# EasyEDA schematic SCH_LED-Matrix-Halflife_2026-10-07.json
TITLE: Sheet_1; REV: 1.0; Date: 2026-10-07; Sheet: 1/1; Drawn By: Farouk; Company: Your Company
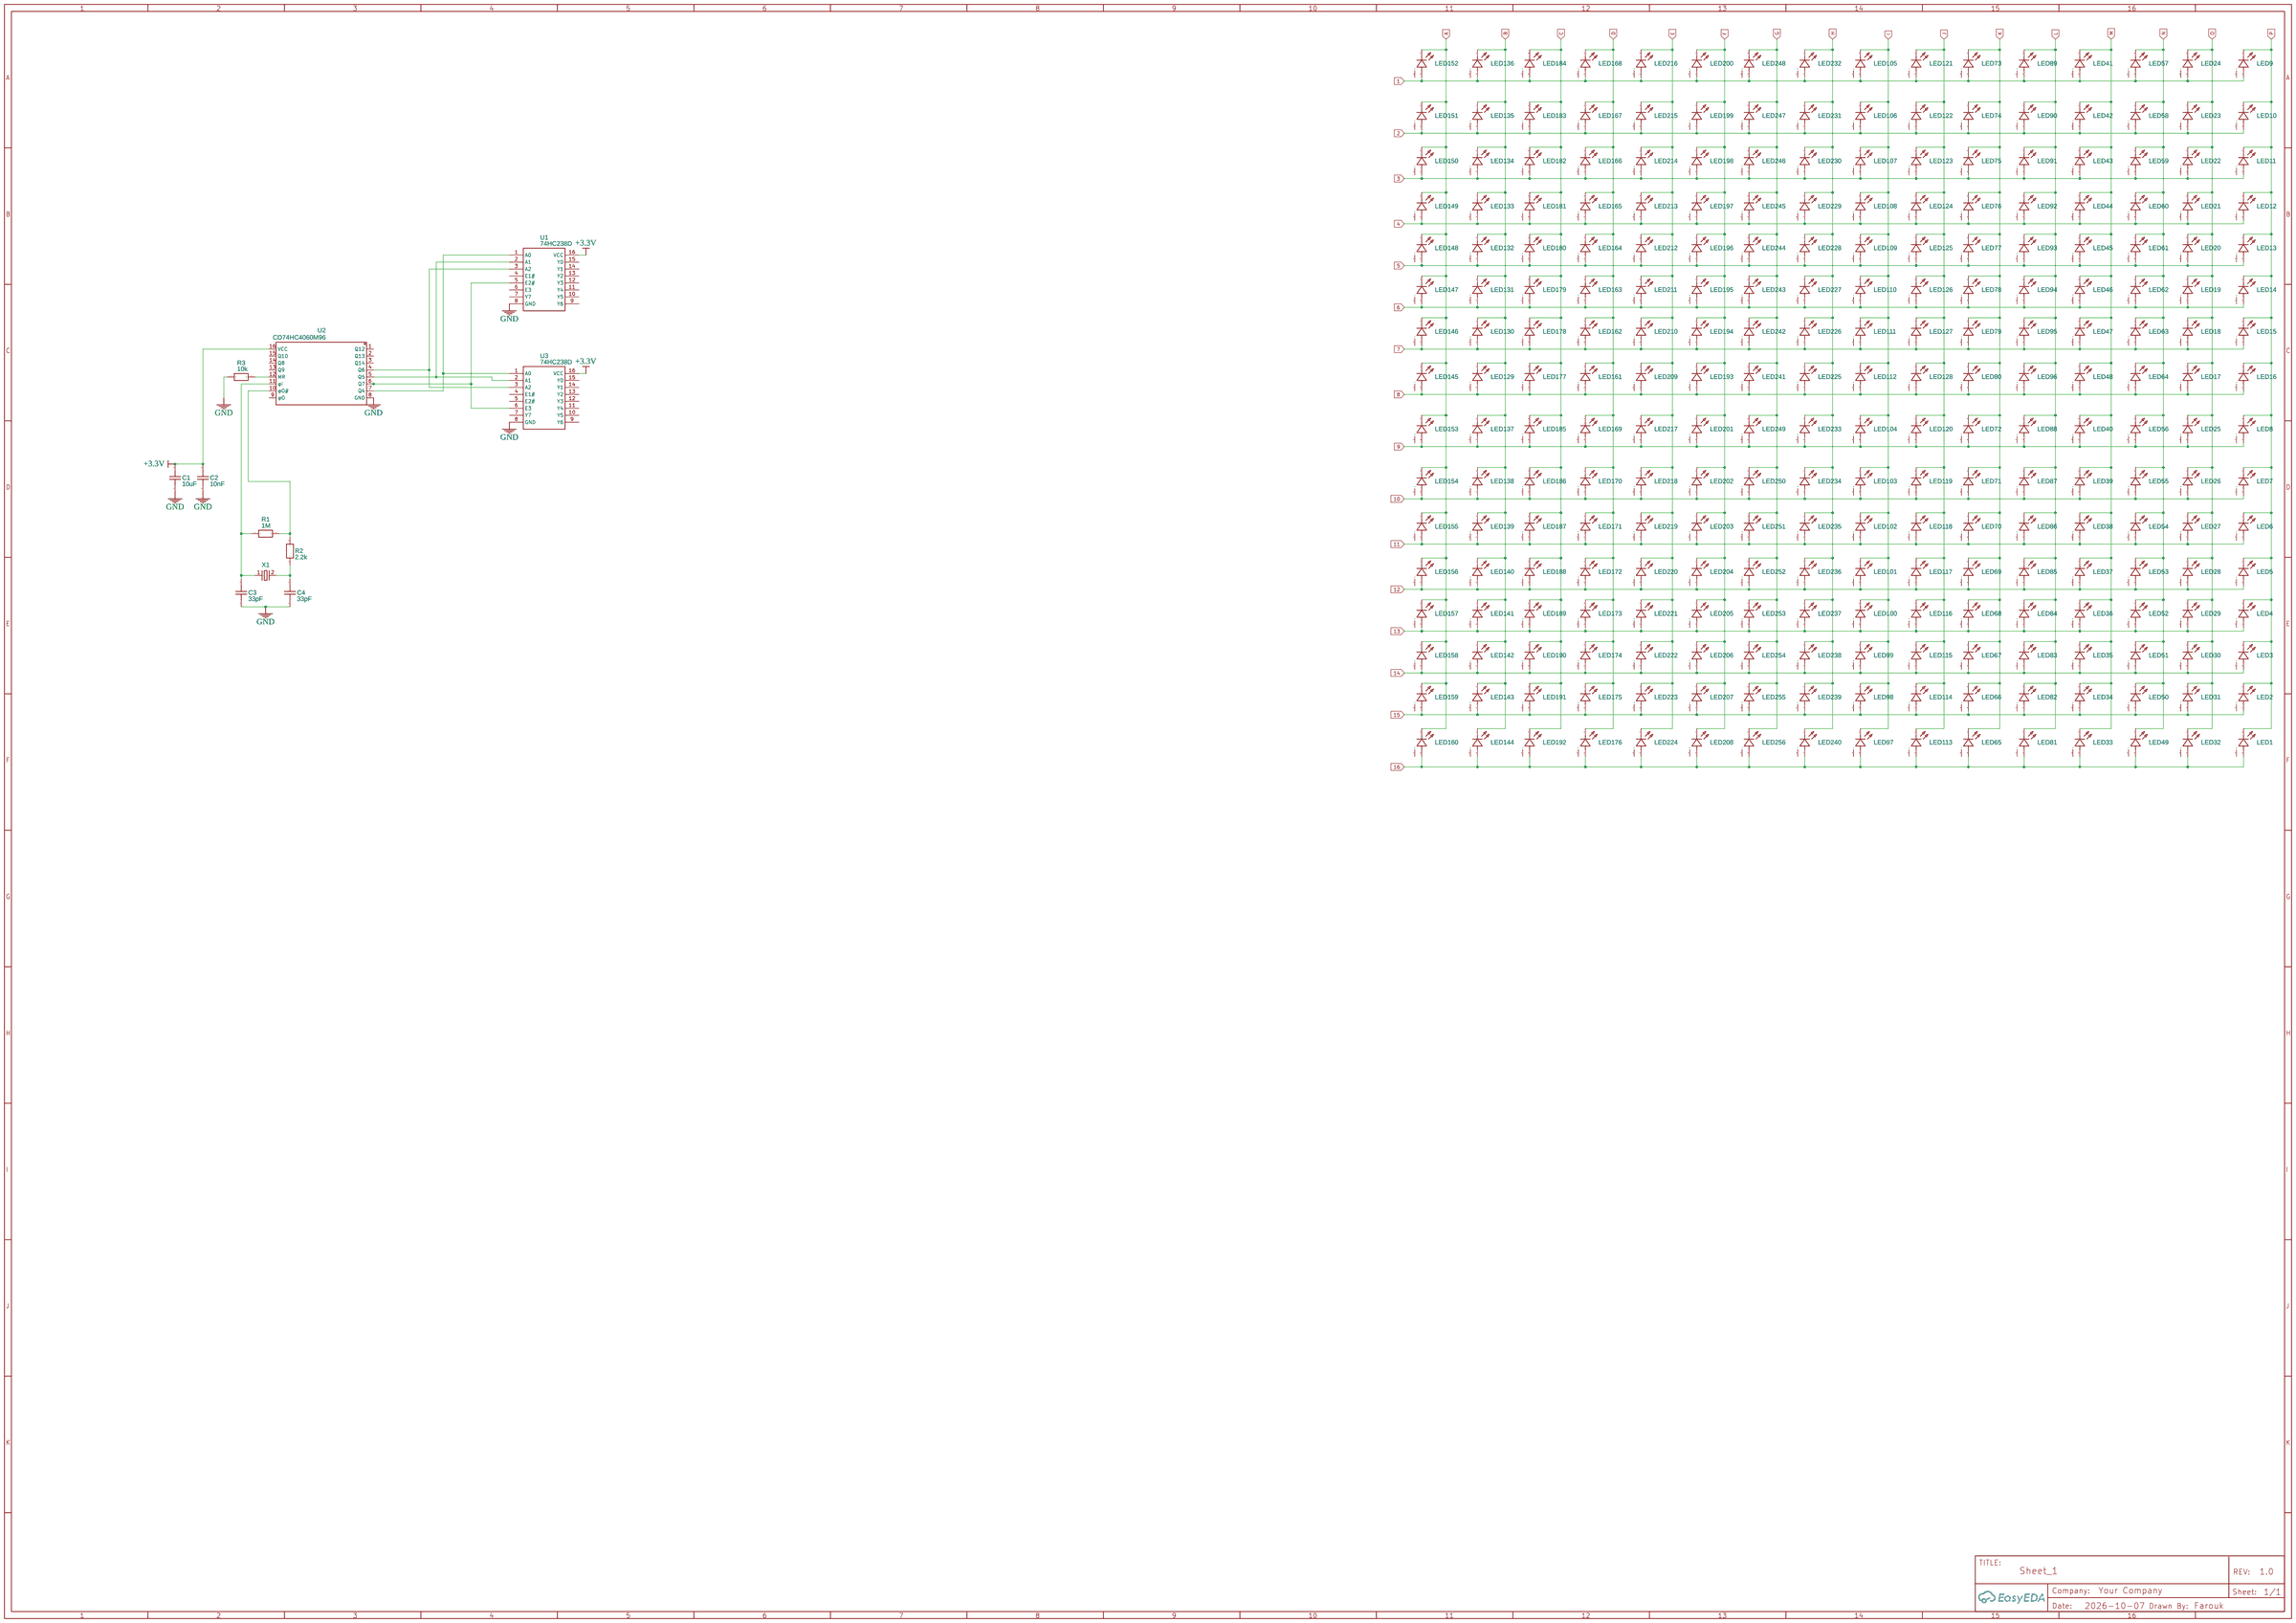
[diagram p0: schematic sheet]

## Parts
C1  10uF  [C1210]
C2  10nF  [C0805]
C3  33pF  [C0805]
C4  33pF  [C0805]
LED1  HL-A-5730D34WY-S1-08-CZ(LY)  [LED-SMD_HL-A-5730D34WY-S1-08-CZ]
LED2  HL-A-5730D34WY-S1-08-CZ(LY)  [LED-SMD_HL-A-5730D34WY-S1-08-CZ]
LED3  HL-A-5730D34WY-S1-08-CZ(LY)  [LED-SMD_HL-A-5730D34WY-S1-08-CZ]
LED4  HL-A-5730D34WY-S1-08-CZ(LY)  [LED-SMD_HL-A-5730D34WY-S1-08-CZ]
LED5  HL-A-5730D34WY-S1-08-CZ(LY)  [LED-SMD_HL-A-5730D34WY-S1-08-CZ]
LED6  HL-A-5730D34WY-S1-08-CZ(LY)  [LED-SMD_HL-A-5730D34WY-S1-08-CZ]
LED7  HL-A-5730D34WY-S1-08-CZ(LY)  [LED-SMD_HL-A-5730D34WY-S1-08-CZ]
LED8  HL-A-5730D34WY-S1-08-CZ(LY)  [LED-SMD_HL-A-5730D34WY-S1-08-CZ]
LED9  HL-A-5730D34WY-S1-08-CZ(LY)  [LED-SMD_HL-A-5730D34WY-S1-08-CZ]
LED10  HL-A-5730D34WY-S1-08-CZ(LY)  [LED-SMD_HL-A-5730D34WY-S1-08-CZ]
LED11  HL-A-5730D34WY-S1-08-CZ(LY)  [LED-SMD_HL-A-5730D34WY-S1-08-CZ]
LED12  HL-A-5730D34WY-S1-08-CZ(LY)  [LED-SMD_HL-A-5730D34WY-S1-08-CZ]
LED13  HL-A-5730D34WY-S1-08-CZ(LY)  [LED-SMD_HL-A-5730D34WY-S1-08-CZ]
LED14  HL-A-5730D34WY-S1-08-CZ(LY)  [LED-SMD_HL-A-5730D34WY-S1-08-CZ]
LED15  HL-A-5730D34WY-S1-08-CZ(LY)  [LED-SMD_HL-A-5730D34WY-S1-08-CZ]
LED16  HL-A-5730D34WY-S1-08-CZ(LY)  [LED-SMD_HL-A-5730D34WY-S1-08-CZ]
LED17  HL-A-5730D34WY-S1-08-CZ(LY)  [LED-SMD_HL-A-5730D34WY-S1-08-CZ]
LED18  HL-A-5730D34WY-S1-08-CZ(LY)  [LED-SMD_HL-A-5730D34WY-S1-08-CZ]
LED19  HL-A-5730D34WY-S1-08-CZ(LY)  [LED-SMD_HL-A-5730D34WY-S1-08-CZ]
LED20  HL-A-5730D34WY-S1-08-CZ(LY)  [LED-SMD_HL-A-5730D34WY-S1-08-CZ]
LED21  HL-A-5730D34WY-S1-08-CZ(LY)  [LED-SMD_HL-A-5730D34WY-S1-08-CZ]
LED22  HL-A-5730D34WY-S1-08-CZ(LY)  [LED-SMD_HL-A-5730D34WY-S1-08-CZ]
LED23  HL-A-5730D34WY-S1-08-CZ(LY)  [LED-SMD_HL-A-5730D34WY-S1-08-CZ]
LED24  HL-A-5730D34WY-S1-08-CZ(LY)  [LED-SMD_HL-A-5730D34WY-S1-08-CZ]
LED25  HL-A-5730D34WY-S1-08-CZ(LY)  [LED-SMD_HL-A-5730D34WY-S1-08-CZ]
LED26  HL-A-5730D34WY-S1-08-CZ(LY)  [LED-SMD_HL-A-5730D34WY-S1-08-CZ]
LED27  HL-A-5730D34WY-S1-08-CZ(LY)  [LED-SMD_HL-A-5730D34WY-S1-08-CZ]
LED28  HL-A-5730D34WY-S1-08-CZ(LY)  [LED-SMD_HL-A-5730D34WY-S1-08-CZ]
LED29  HL-A-5730D34WY-S1-08-CZ(LY)  [LED-SMD_HL-A-5730D34WY-S1-08-CZ]
LED30  HL-A-5730D34WY-S1-08-CZ(LY)  [LED-SMD_HL-A-5730D34WY-S1-08-CZ]
LED31  HL-A-5730D34WY-S1-08-CZ(LY)  [LED-SMD_HL-A-5730D34WY-S1-08-CZ]
LED32  HL-A-5730D34WY-S1-08-CZ(LY)  [LED-SMD_HL-A-5730D34WY-S1-08-CZ]
LED33  HL-A-5730D34WY-S1-08-CZ(LY)  [LED-SMD_HL-A-5730D34WY-S1-08-CZ]
LED34  HL-A-5730D34WY-S1-08-CZ(LY)  [LED-SMD_HL-A-5730D34WY-S1-08-CZ]
LED35  HL-A-5730D34WY-S1-08-CZ(LY)  [LED-SMD_HL-A-5730D34WY-S1-08-CZ]
LED36  HL-A-5730D34WY-S1-08-CZ(LY)  [LED-SMD_HL-A-5730D34WY-S1-08-CZ]
LED37  HL-A-5730D34WY-S1-08-CZ(LY)  [LED-SMD_HL-A-5730D34WY-S1-08-CZ]
LED38  HL-A-5730D34WY-S1-08-CZ(LY)  [LED-SMD_HL-A-5730D34WY-S1-08-CZ]
LED39  HL-A-5730D34WY-S1-08-CZ(LY)  [LED-SMD_HL-A-5730D34WY-S1-08-CZ]
LED40  HL-A-5730D34WY-S1-08-CZ(LY)  [LED-SMD_HL-A-5730D34WY-S1-08-CZ]
LED41  HL-A-5730D34WY-S1-08-CZ(LY)  [LED-SMD_HL-A-5730D34WY-S1-08-CZ]
LED42  HL-A-5730D34WY-S1-08-CZ(LY)  [LED-SMD_HL-A-5730D34WY-S1-08-CZ]
LED43  HL-A-5730D34WY-S1-08-CZ(LY)  [LED-SMD_HL-A-5730D34WY-S1-08-CZ]
LED44  HL-A-5730D34WY-S1-08-CZ(LY)  [LED-SMD_HL-A-5730D34WY-S1-08-CZ]
LED45  HL-A-5730D34WY-S1-08-CZ(LY)  [LED-SMD_HL-A-5730D34WY-S1-08-CZ]
LED46  HL-A-5730D34WY-S1-08-CZ(LY)  [LED-SMD_HL-A-5730D34WY-S1-08-CZ]
LED47  HL-A-5730D34WY-S1-08-CZ(LY)  [LED-SMD_HL-A-5730D34WY-S1-08-CZ]
LED48  HL-A-5730D34WY-S1-08-CZ(LY)  [LED-SMD_HL-A-5730D34WY-S1-08-CZ]
LED49  HL-A-5730D34WY-S1-08-CZ(LY)  [LED-SMD_HL-A-5730D34WY-S1-08-CZ]
LED50  HL-A-5730D34WY-S1-08-CZ(LY)  [LED-SMD_HL-A-5730D34WY-S1-08-CZ]
LED51  HL-A-5730D34WY-S1-08-CZ(LY)  [LED-SMD_HL-A-5730D34WY-S1-08-CZ]
LED52  HL-A-5730D34WY-S1-08-CZ(LY)  [LED-SMD_HL-A-5730D34WY-S1-08-CZ]
LED53  HL-A-5730D34WY-S1-08-CZ(LY)  [LED-SMD_HL-A-5730D34WY-S1-08-CZ]
LED54  HL-A-5730D34WY-S1-08-CZ(LY)  [LED-SMD_HL-A-5730D34WY-S1-08-CZ]
LED55  HL-A-5730D34WY-S1-08-CZ(LY)  [LED-SMD_HL-A-5730D34WY-S1-08-CZ]
LED56  HL-A-5730D34WY-S1-08-CZ(LY)  [LED-SMD_HL-A-5730D34WY-S1-08-CZ]
LED57  HL-A-5730D34WY-S1-08-CZ(LY)  [LED-SMD_HL-A-5730D34WY-S1-08-CZ]
LED58  HL-A-5730D34WY-S1-08-CZ(LY)  [LED-SMD_HL-A-5730D34WY-S1-08-CZ]
LED59  HL-A-5730D34WY-S1-08-CZ(LY)  [LED-SMD_HL-A-5730D34WY-S1-08-CZ]
LED60  HL-A-5730D34WY-S1-08-CZ(LY)  [LED-SMD_HL-A-5730D34WY-S1-08-CZ]
LED61  HL-A-5730D34WY-S1-08-CZ(LY)  [LED-SMD_HL-A-5730D34WY-S1-08-CZ]
LED62  HL-A-5730D34WY-S1-08-CZ(LY)  [LED-SMD_HL-A-5730D34WY-S1-08-CZ]
LED63  HL-A-5730D34WY-S1-08-CZ(LY)  [LED-SMD_HL-A-5730D34WY-S1-08-CZ]
LED64  HL-A-5730D34WY-S1-08-CZ(LY)  [LED-SMD_HL-A-5730D34WY-S1-08-CZ]
LED65  HL-A-5730D34WY-S1-08-CZ(LY)  [LED-SMD_HL-A-5730D34WY-S1-08-CZ]
LED66  HL-A-5730D34WY-S1-08-CZ(LY)  [LED-SMD_HL-A-5730D34WY-S1-08-CZ]
LED67  HL-A-5730D34WY-S1-08-CZ(LY)  [LED-SMD_HL-A-5730D34WY-S1-08-CZ]
LED68  HL-A-5730D34WY-S1-08-CZ(LY)  [LED-SMD_HL-A-5730D34WY-S1-08-CZ]
LED69  HL-A-5730D34WY-S1-08-CZ(LY)  [LED-SMD_HL-A-5730D34WY-S1-08-CZ]
LED70  HL-A-5730D34WY-S1-08-CZ(LY)  [LED-SMD_HL-A-5730D34WY-S1-08-CZ]
LED71  HL-A-5730D34WY-S1-08-CZ(LY)  [LED-SMD_HL-A-5730D34WY-S1-08-CZ]
LED72  HL-A-5730D34WY-S1-08-CZ(LY)  [LED-SMD_HL-A-5730D34WY-S1-08-CZ]
LED73  HL-A-5730D34WY-S1-08-CZ(LY)  [LED-SMD_HL-A-5730D34WY-S1-08-CZ]
LED74  HL-A-5730D34WY-S1-08-CZ(LY)  [LED-SMD_HL-A-5730D34WY-S1-08-CZ]
LED75  HL-A-5730D34WY-S1-08-CZ(LY)  [LED-SMD_HL-A-5730D34WY-S1-08-CZ]
LED76  HL-A-5730D34WY-S1-08-CZ(LY)  [LED-SMD_HL-A-5730D34WY-S1-08-CZ]
LED77  HL-A-5730D34WY-S1-08-CZ(LY)  [LED-SMD_HL-A-5730D34WY-S1-08-CZ]
LED78  HL-A-5730D34WY-S1-08-CZ(LY)  [LED-SMD_HL-A-5730D34WY-S1-08-CZ]
LED79  HL-A-5730D34WY-S1-08-CZ(LY)  [LED-SMD_HL-A-5730D34WY-S1-08-CZ]
LED80  HL-A-5730D34WY-S1-08-CZ(LY)  [LED-SMD_HL-A-5730D34WY-S1-08-CZ]
LED81  HL-A-5730D34WY-S1-08-CZ(LY)  [LED-SMD_HL-A-5730D34WY-S1-08-CZ]
LED82  HL-A-5730D34WY-S1-08-CZ(LY)  [LED-SMD_HL-A-5730D34WY-S1-08-CZ]
LED83  HL-A-5730D34WY-S1-08-CZ(LY)  [LED-SMD_HL-A-5730D34WY-S1-08-CZ]
LED84  HL-A-5730D34WY-S1-08-CZ(LY)  [LED-SMD_HL-A-5730D34WY-S1-08-CZ]
LED85  HL-A-5730D34WY-S1-08-CZ(LY)  [LED-SMD_HL-A-5730D34WY-S1-08-CZ]
LED86  HL-A-5730D34WY-S1-08-CZ(LY)  [LED-SMD_HL-A-5730D34WY-S1-08-CZ]
LED87  HL-A-5730D34WY-S1-08-CZ(LY)  [LED-SMD_HL-A-5730D34WY-S1-08-CZ]
LED88  HL-A-5730D34WY-S1-08-CZ(LY)  [LED-SMD_HL-A-5730D34WY-S1-08-CZ]
LED89  HL-A-5730D34WY-S1-08-CZ(LY)  [LED-SMD_HL-A-5730D34WY-S1-08-CZ]
LED90  HL-A-5730D34WY-S1-08-CZ(LY)  [LED-SMD_HL-A-5730D34WY-S1-08-CZ]
LED91  HL-A-5730D34WY-S1-08-CZ(LY)  [LED-SMD_HL-A-5730D34WY-S1-08-CZ]
LED92  HL-A-5730D34WY-S1-08-CZ(LY)  [LED-SMD_HL-A-5730D34WY-S1-08-CZ]
LED93  HL-A-5730D34WY-S1-08-CZ(LY)  [LED-SMD_HL-A-5730D34WY-S1-08-CZ]
LED94  HL-A-5730D34WY-S1-08-CZ(LY)  [LED-SMD_HL-A-5730D34WY-S1-08-CZ]
LED95  HL-A-5730D34WY-S1-08-CZ(LY)  [LED-SMD_HL-A-5730D34WY-S1-08-CZ]
LED96  HL-A-5730D34WY-S1-08-CZ(LY)  [LED-SMD_HL-A-5730D34WY-S1-08-CZ]
LED97  HL-A-5730D34WY-S1-08-CZ(LY)  [LED-SMD_HL-A-5730D34WY-S1-08-CZ]
LED98  HL-A-5730D34WY-S1-08-CZ(LY)  [LED-SMD_HL-A-5730D34WY-S1-08-CZ]
LED99  HL-A-5730D34WY-S1-08-CZ(LY)  [LED-SMD_HL-A-5730D34WY-S1-08-CZ]
LED100  HL-A-5730D34WY-S1-08-CZ(LY)  [LED-SMD_HL-A-5730D34WY-S1-08-CZ]
LED101  HL-A-5730D34WY-S1-08-CZ(LY)  [LED-SMD_HL-A-5730D34WY-S1-08-CZ]
LED102  HL-A-5730D34WY-S1-08-CZ(LY)  [LED-SMD_HL-A-5730D34WY-S1-08-CZ]
LED103  HL-A-5730D34WY-S1-08-CZ(LY)  [LED-SMD_HL-A-5730D34WY-S1-08-CZ]
LED104  HL-A-5730D34WY-S1-08-CZ(LY)  [LED-SMD_HL-A-5730D34WY-S1-08-CZ]
LED105  HL-A-5730D34WY-S1-08-CZ(LY)  [LED-SMD_HL-A-5730D34WY-S1-08-CZ]
LED106  HL-A-5730D34WY-S1-08-CZ(LY)  [LED-SMD_HL-A-5730D34WY-S1-08-CZ]
LED107  HL-A-5730D34WY-S1-08-CZ(LY)  [LED-SMD_HL-A-5730D34WY-S1-08-CZ]
LED108  HL-A-5730D34WY-S1-08-CZ(LY)  [LED-SMD_HL-A-5730D34WY-S1-08-CZ]
LED109  HL-A-5730D34WY-S1-08-CZ(LY)  [LED-SMD_HL-A-5730D34WY-S1-08-CZ]
LED110  HL-A-5730D34WY-S1-08-CZ(LY)  [LED-SMD_HL-A-5730D34WY-S1-08-CZ]
LED111  HL-A-5730D34WY-S1-08-CZ(LY)  [LED-SMD_HL-A-5730D34WY-S1-08-CZ]
LED112  HL-A-5730D34WY-S1-08-CZ(LY)  [LED-SMD_HL-A-5730D34WY-S1-08-CZ]
LED113  HL-A-5730D34WY-S1-08-CZ(LY)  [LED-SMD_HL-A-5730D34WY-S1-08-CZ]
LED114  HL-A-5730D34WY-S1-08-CZ(LY)  [LED-SMD_HL-A-5730D34WY-S1-08-CZ]
LED115  HL-A-5730D34WY-S1-08-CZ(LY)  [LED-SMD_HL-A-5730D34WY-S1-08-CZ]
LED116  HL-A-5730D34WY-S1-08-CZ(LY)  [LED-SMD_HL-A-5730D34WY-S1-08-CZ]
LED117  HL-A-5730D34WY-S1-08-CZ(LY)  [LED-SMD_HL-A-5730D34WY-S1-08-CZ]
LED118  HL-A-5730D34WY-S1-08-CZ(LY)  [LED-SMD_HL-A-5730D34WY-S1-08-CZ]
LED119  HL-A-5730D34WY-S1-08-CZ(LY)  [LED-SMD_HL-A-5730D34WY-S1-08-CZ]
LED120  HL-A-5730D34WY-S1-08-CZ(LY)  [LED-SMD_HL-A-5730D34WY-S1-08-CZ]
LED121  HL-A-5730D34WY-S1-08-CZ(LY)  [LED-SMD_HL-A-5730D34WY-S1-08-CZ]
LED122  HL-A-5730D34WY-S1-08-CZ(LY)  [LED-SMD_HL-A-5730D34WY-S1-08-CZ]
LED123  HL-A-5730D34WY-S1-08-CZ(LY)  [LED-SMD_HL-A-5730D34WY-S1-08-CZ]
LED124  HL-A-5730D34WY-S1-08-CZ(LY)  [LED-SMD_HL-A-5730D34WY-S1-08-CZ]
LED125  HL-A-5730D34WY-S1-08-CZ(LY)  [LED-SMD_HL-A-5730D34WY-S1-08-CZ]
LED126  HL-A-5730D34WY-S1-08-CZ(LY)  [LED-SMD_HL-A-5730D34WY-S1-08-CZ]
LED127  HL-A-5730D34WY-S1-08-CZ(LY)  [LED-SMD_HL-A-5730D34WY-S1-08-CZ]
LED128  HL-A-5730D34WY-S1-08-CZ(LY)  [LED-SMD_HL-A-5730D34WY-S1-08-CZ]
LED129  HL-A-5730D34WY-S1-08-CZ(LY)  [LED-SMD_HL-A-5730D34WY-S1-08-CZ]
LED130  HL-A-5730D34WY-S1-08-CZ(LY)  [LED-SMD_HL-A-5730D34WY-S1-08-CZ]
LED131  HL-A-5730D34WY-S1-08-CZ(LY)  [LED-SMD_HL-A-5730D34WY-S1-08-CZ]
LED132  HL-A-5730D34WY-S1-08-CZ(LY)  [LED-SMD_HL-A-5730D34WY-S1-08-CZ]
LED133  HL-A-5730D34WY-S1-08-CZ(LY)  [LED-SMD_HL-A-5730D34WY-S1-08-CZ]
LED134  HL-A-5730D34WY-S1-08-CZ(LY)  [LED-SMD_HL-A-5730D34WY-S1-08-CZ]
LED135  HL-A-5730D34WY-S1-08-CZ(LY)  [LED-SMD_HL-A-5730D34WY-S1-08-CZ]
LED136  HL-A-5730D34WY-S1-08-CZ(LY)  [LED-SMD_HL-A-5730D34WY-S1-08-CZ]
LED137  HL-A-5730D34WY-S1-08-CZ(LY)  [LED-SMD_HL-A-5730D34WY-S1-08-CZ]
LED138  HL-A-5730D34WY-S1-08-CZ(LY)  [LED-SMD_HL-A-5730D34WY-S1-08-CZ]
LED139  HL-A-5730D34WY-S1-08-CZ(LY)  [LED-SMD_HL-A-5730D34WY-S1-08-CZ]
LED140  HL-A-5730D34WY-S1-08-CZ(LY)  [LED-SMD_HL-A-5730D34WY-S1-08-CZ]
LED141  HL-A-5730D34WY-S1-08-CZ(LY)  [LED-SMD_HL-A-5730D34WY-S1-08-CZ]
LED142  HL-A-5730D34WY-S1-08-CZ(LY)  [LED-SMD_HL-A-5730D34WY-S1-08-CZ]
LED143  HL-A-5730D34WY-S1-08-CZ(LY)  [LED-SMD_HL-A-5730D34WY-S1-08-CZ]
LED144  HL-A-5730D34WY-S1-08-CZ(LY)  [LED-SMD_HL-A-5730D34WY-S1-08-CZ]
LED145  HL-A-5730D34WY-S1-08-CZ(LY)  [LED-SMD_HL-A-5730D34WY-S1-08-CZ]
LED146  HL-A-5730D34WY-S1-08-CZ(LY)  [LED-SMD_HL-A-5730D34WY-S1-08-CZ]
LED147  HL-A-5730D34WY-S1-08-CZ(LY)  [LED-SMD_HL-A-5730D34WY-S1-08-CZ]
LED148  HL-A-5730D34WY-S1-08-CZ(LY)  [LED-SMD_HL-A-5730D34WY-S1-08-CZ]
LED149  HL-A-5730D34WY-S1-08-CZ(LY)  [LED-SMD_HL-A-5730D34WY-S1-08-CZ]
LED150  HL-A-5730D34WY-S1-08-CZ(LY)  [LED-SMD_HL-A-5730D34WY-S1-08-CZ]
LED151  HL-A-5730D34WY-S1-08-CZ(LY)  [LED-SMD_HL-A-5730D34WY-S1-08-CZ]
LED152  HL-A-5730D34WY-S1-08-CZ(LY)  [LED-SMD_HL-A-5730D34WY-S1-08-CZ]
LED153  HL-A-5730D34WY-S1-08-CZ(LY)  [LED-SMD_HL-A-5730D34WY-S1-08-CZ]
LED154  HL-A-5730D34WY-S1-08-CZ(LY)  [LED-SMD_HL-A-5730D34WY-S1-08-CZ]
LED155  HL-A-5730D34WY-S1-08-CZ(LY)  [LED-SMD_HL-A-5730D34WY-S1-08-CZ]
LED156  HL-A-5730D34WY-S1-08-CZ(LY)  [LED-SMD_HL-A-5730D34WY-S1-08-CZ]
LED157  HL-A-5730D34WY-S1-08-CZ(LY)  [LED-SMD_HL-A-5730D34WY-S1-08-CZ]
LED158  HL-A-5730D34WY-S1-08-CZ(LY)  [LED-SMD_HL-A-5730D34WY-S1-08-CZ]
LED159  HL-A-5730D34WY-S1-08-CZ(LY)  [LED-SMD_HL-A-5730D34WY-S1-08-CZ]
LED160  HL-A-5730D34WY-S1-08-CZ(LY)  [LED-SMD_HL-A-5730D34WY-S1-08-CZ]
LED161  HL-A-5730D34WY-S1-08-CZ(LY)  [LED-SMD_HL-A-5730D34WY-S1-08-CZ]
LED162  HL-A-5730D34WY-S1-08-CZ(LY)  [LED-SMD_HL-A-5730D34WY-S1-08-CZ]
LED163  HL-A-5730D34WY-S1-08-CZ(LY)  [LED-SMD_HL-A-5730D34WY-S1-08-CZ]
LED164  HL-A-5730D34WY-S1-08-CZ(LY)  [LED-SMD_HL-A-5730D34WY-S1-08-CZ]
LED165  HL-A-5730D34WY-S1-08-CZ(LY)  [LED-SMD_HL-A-5730D34WY-S1-08-CZ]
LED166  HL-A-5730D34WY-S1-08-CZ(LY)  [LED-SMD_HL-A-5730D34WY-S1-08-CZ]
LED167  HL-A-5730D34WY-S1-08-CZ(LY)  [LED-SMD_HL-A-5730D34WY-S1-08-CZ]
LED168  HL-A-5730D34WY-S1-08-CZ(LY)  [LED-SMD_HL-A-5730D34WY-S1-08-CZ]
LED169  HL-A-5730D34WY-S1-08-CZ(LY)  [LED-SMD_HL-A-5730D34WY-S1-08-CZ]
LED170  HL-A-5730D34WY-S1-08-CZ(LY)  [LED-SMD_HL-A-5730D34WY-S1-08-CZ]
LED171  HL-A-5730D34WY-S1-08-CZ(LY)  [LED-SMD_HL-A-5730D34WY-S1-08-CZ]
LED172  HL-A-5730D34WY-S1-08-CZ(LY)  [LED-SMD_HL-A-5730D34WY-S1-08-CZ]
LED173  HL-A-5730D34WY-S1-08-CZ(LY)  [LED-SMD_HL-A-5730D34WY-S1-08-CZ]
LED174  HL-A-5730D34WY-S1-08-CZ(LY)  [LED-SMD_HL-A-5730D34WY-S1-08-CZ]
LED175  HL-A-5730D34WY-S1-08-CZ(LY)  [LED-SMD_HL-A-5730D34WY-S1-08-CZ]
LED176  HL-A-5730D34WY-S1-08-CZ(LY)  [LED-SMD_HL-A-5730D34WY-S1-08-CZ]
LED177  HL-A-5730D34WY-S1-08-CZ(LY)  [LED-SMD_HL-A-5730D34WY-S1-08-CZ]
LED178  HL-A-5730D34WY-S1-08-CZ(LY)  [LED-SMD_HL-A-5730D34WY-S1-08-CZ]
LED179  HL-A-5730D34WY-S1-08-CZ(LY)  [LED-SMD_HL-A-5730D34WY-S1-08-CZ]
LED180  HL-A-5730D34WY-S1-08-CZ(LY)  [LED-SMD_HL-A-5730D34WY-S1-08-CZ]
LED181  HL-A-5730D34WY-S1-08-CZ(LY)  [LED-SMD_HL-A-5730D34WY-S1-08-CZ]
LED182  HL-A-5730D34WY-S1-08-CZ(LY)  [LED-SMD_HL-A-5730D34WY-S1-08-CZ]
LED183  HL-A-5730D34WY-S1-08-CZ(LY)  [LED-SMD_HL-A-5730D34WY-S1-08-CZ]
LED184  HL-A-5730D34WY-S1-08-CZ(LY)  [LED-SMD_HL-A-5730D34WY-S1-08-CZ]
LED185  HL-A-5730D34WY-S1-08-CZ(LY)  [LED-SMD_HL-A-5730D34WY-S1-08-CZ]
LED186  HL-A-5730D34WY-S1-08-CZ(LY)  [LED-SMD_HL-A-5730D34WY-S1-08-CZ]
LED187  HL-A-5730D34WY-S1-08-CZ(LY)  [LED-SMD_HL-A-5730D34WY-S1-08-CZ]
LED188  HL-A-5730D34WY-S1-08-CZ(LY)  [LED-SMD_HL-A-5730D34WY-S1-08-CZ]
LED189  HL-A-5730D34WY-S1-08-CZ(LY)  [LED-SMD_HL-A-5730D34WY-S1-08-CZ]
LED190  HL-A-5730D34WY-S1-08-CZ(LY)  [LED-SMD_HL-A-5730D34WY-S1-08-CZ]
LED191  HL-A-5730D34WY-S1-08-CZ(LY)  [LED-SMD_HL-A-5730D34WY-S1-08-CZ]
LED192  HL-A-5730D34WY-S1-08-CZ(LY)  [LED-SMD_HL-A-5730D34WY-S1-08-CZ]
LED193  HL-A-5730D34WY-S1-08-CZ(LY)  [LED-SMD_HL-A-5730D34WY-S1-08-CZ]
LED194  HL-A-5730D34WY-S1-08-CZ(LY)  [LED-SMD_HL-A-5730D34WY-S1-08-CZ]
LED195  HL-A-5730D34WY-S1-08-CZ(LY)  [LED-SMD_HL-A-5730D34WY-S1-08-CZ]
LED196  HL-A-5730D34WY-S1-08-CZ(LY)  [LED-SMD_HL-A-5730D34WY-S1-08-CZ]
LED197  HL-A-5730D34WY-S1-08-CZ(LY)  [LED-SMD_HL-A-5730D34WY-S1-08-CZ]
LED198  HL-A-5730D34WY-S1-08-CZ(LY)  [LED-SMD_HL-A-5730D34WY-S1-08-CZ]
LED199  HL-A-5730D34WY-S1-08-CZ(LY)  [LED-SMD_HL-A-5730D34WY-S1-08-CZ]
LED200  HL-A-5730D34WY-S1-08-CZ(LY)  [LED-SMD_HL-A-5730D34WY-S1-08-CZ]
LED201  HL-A-5730D34WY-S1-08-CZ(LY)  [LED-SMD_HL-A-5730D34WY-S1-08-CZ]
LED202  HL-A-5730D34WY-S1-08-CZ(LY)  [LED-SMD_HL-A-5730D34WY-S1-08-CZ]
LED203  HL-A-5730D34WY-S1-08-CZ(LY)  [LED-SMD_HL-A-5730D34WY-S1-08-CZ]
LED204  HL-A-5730D34WY-S1-08-CZ(LY)  [LED-SMD_HL-A-5730D34WY-S1-08-CZ]
LED205  HL-A-5730D34WY-S1-08-CZ(LY)  [LED-SMD_HL-A-5730D34WY-S1-08-CZ]
LED206  HL-A-5730D34WY-S1-08-CZ(LY)  [LED-SMD_HL-A-5730D34WY-S1-08-CZ]
LED207  HL-A-5730D34WY-S1-08-CZ(LY)  [LED-SMD_HL-A-5730D34WY-S1-08-CZ]
LED208  HL-A-5730D34WY-S1-08-CZ(LY)  [LED-SMD_HL-A-5730D34WY-S1-08-CZ]
LED209  HL-A-5730D34WY-S1-08-CZ(LY)  [LED-SMD_HL-A-5730D34WY-S1-08-CZ]
LED210  HL-A-5730D34WY-S1-08-CZ(LY)  [LED-SMD_HL-A-5730D34WY-S1-08-CZ]
LED211  HL-A-5730D34WY-S1-08-CZ(LY)  [LED-SMD_HL-A-5730D34WY-S1-08-CZ]
LED212  HL-A-5730D34WY-S1-08-CZ(LY)  [LED-SMD_HL-A-5730D34WY-S1-08-CZ]
LED213  HL-A-5730D34WY-S1-08-CZ(LY)  [LED-SMD_HL-A-5730D34WY-S1-08-CZ]
LED214  HL-A-5730D34WY-S1-08-CZ(LY)  [LED-SMD_HL-A-5730D34WY-S1-08-CZ]
LED215  HL-A-5730D34WY-S1-08-CZ(LY)  [LED-SMD_HL-A-5730D34WY-S1-08-CZ]
LED216  HL-A-5730D34WY-S1-08-CZ(LY)  [LED-SMD_HL-A-5730D34WY-S1-08-CZ]
LED217  HL-A-5730D34WY-S1-08-CZ(LY)  [LED-SMD_HL-A-5730D34WY-S1-08-CZ]
LED218  HL-A-5730D34WY-S1-08-CZ(LY)  [LED-SMD_HL-A-5730D34WY-S1-08-CZ]
LED219  HL-A-5730D34WY-S1-08-CZ(LY)  [LED-SMD_HL-A-5730D34WY-S1-08-CZ]
LED220  HL-A-5730D34WY-S1-08-CZ(LY)  [LED-SMD_HL-A-5730D34WY-S1-08-CZ]
LED221  HL-A-5730D34WY-S1-08-CZ(LY)  [LED-SMD_HL-A-5730D34WY-S1-08-CZ]
LED222  HL-A-5730D34WY-S1-08-CZ(LY)  [LED-SMD_HL-A-5730D34WY-S1-08-CZ]
LED223  HL-A-5730D34WY-S1-08-CZ(LY)  [LED-SMD_HL-A-5730D34WY-S1-08-CZ]
LED224  HL-A-5730D34WY-S1-08-CZ(LY)  [LED-SMD_HL-A-5730D34WY-S1-08-CZ]
LED225  HL-A-5730D34WY-S1-08-CZ(LY)  [LED-SMD_HL-A-5730D34WY-S1-08-CZ]
LED226  HL-A-5730D34WY-S1-08-CZ(LY)  [LED-SMD_HL-A-5730D34WY-S1-08-CZ]
LED227  HL-A-5730D34WY-S1-08-CZ(LY)  [LED-SMD_HL-A-5730D34WY-S1-08-CZ]
LED228  HL-A-5730D34WY-S1-08-CZ(LY)  [LED-SMD_HL-A-5730D34WY-S1-08-CZ]
LED229  HL-A-5730D34WY-S1-08-CZ(LY)  [LED-SMD_HL-A-5730D34WY-S1-08-CZ]
LED230  HL-A-5730D34WY-S1-08-CZ(LY)  [LED-SMD_HL-A-5730D34WY-S1-08-CZ]
LED231  HL-A-5730D34WY-S1-08-CZ(LY)  [LED-SMD_HL-A-5730D34WY-S1-08-CZ]
LED232  HL-A-5730D34WY-S1-08-CZ(LY)  [LED-SMD_HL-A-5730D34WY-S1-08-CZ]
LED233  HL-A-5730D34WY-S1-08-CZ(LY)  [LED-SMD_HL-A-5730D34WY-S1-08-CZ]
LED234  HL-A-5730D34WY-S1-08-CZ(LY)  [LED-SMD_HL-A-5730D34WY-S1-08-CZ]
LED235  HL-A-5730D34WY-S1-08-CZ(LY)  [LED-SMD_HL-A-5730D34WY-S1-08-CZ]
LED236  HL-A-5730D34WY-S1-08-CZ(LY)  [LED-SMD_HL-A-5730D34WY-S1-08-CZ]
LED237  HL-A-5730D34WY-S1-08-CZ(LY)  [LED-SMD_HL-A-5730D34WY-S1-08-CZ]
LED238  HL-A-5730D34WY-S1-08-CZ(LY)  [LED-SMD_HL-A-5730D34WY-S1-08-CZ]
LED239  HL-A-5730D34WY-S1-08-CZ(LY)  [LED-SMD_HL-A-5730D34WY-S1-08-CZ]
LED240  HL-A-5730D34WY-S1-08-CZ(LY)  [LED-SMD_HL-A-5730D34WY-S1-08-CZ]
LED241  HL-A-5730D34WY-S1-08-CZ(LY)  [LED-SMD_HL-A-5730D34WY-S1-08-CZ]
LED242  HL-A-5730D34WY-S1-08-CZ(LY)  [LED-SMD_HL-A-5730D34WY-S1-08-CZ]
LED243  HL-A-5730D34WY-S1-08-CZ(LY)  [LED-SMD_HL-A-5730D34WY-S1-08-CZ]
LED244  HL-A-5730D34WY-S1-08-CZ(LY)  [LED-SMD_HL-A-5730D34WY-S1-08-CZ]
LED245  HL-A-5730D34WY-S1-08-CZ(LY)  [LED-SMD_HL-A-5730D34WY-S1-08-CZ]
LED246  HL-A-5730D34WY-S1-08-CZ(LY)  [LED-SMD_HL-A-5730D34WY-S1-08-CZ]
LED247  HL-A-5730D34WY-S1-08-CZ(LY)  [LED-SMD_HL-A-5730D34WY-S1-08-CZ]
LED248  HL-A-5730D34WY-S1-08-CZ(LY)  [LED-SMD_HL-A-5730D34WY-S1-08-CZ]
LED249  HL-A-5730D34WY-S1-08-CZ(LY)  [LED-SMD_HL-A-5730D34WY-S1-08-CZ]
LED250  HL-A-5730D34WY-S1-08-CZ(LY)  [LED-SMD_HL-A-5730D34WY-S1-08-CZ]
LED251  HL-A-5730D34WY-S1-08-CZ(LY)  [LED-SMD_HL-A-5730D34WY-S1-08-CZ]
LED252  HL-A-5730D34WY-S1-08-CZ(LY)  [LED-SMD_HL-A-5730D34WY-S1-08-CZ]
LED253  HL-A-5730D34WY-S1-08-CZ(LY)  [LED-SMD_HL-A-5730D34WY-S1-08-CZ]
LED254  HL-A-5730D34WY-S1-08-CZ(LY)  [LED-SMD_HL-A-5730D34WY-S1-08-CZ]
LED255  HL-A-5730D34WY-S1-08-CZ(LY)  [LED-SMD_HL-A-5730D34WY-S1-08-CZ]
LED256  HL-A-5730D34WY-S1-08-CZ(LY)  [LED-SMD_HL-A-5730D34WY-S1-08-CZ]
R1  1M  [R0603]
R2  2.2k  [R0603]
R3  10k  [R0603]
U1  74HC238D  [SOIC-16_L9.9-W3.9-P1.27-LS6.0-BL]
U2  CD74HC4060M96  [SOIC-16_L10.8-W4.5-P1.27-LS6.8-BL]
U3  74HC238D  [SOIC-16_L9.9-W3.9-P1.27-LS6.0-BL]
X1  32.768kHz  [CRYSTAL-SMD_L3.2-W1.5-FC-135R32.7680KF-A3]

## Library data of the parts
C1 = CC1210Y5V16V106ZN: Supplier: LCSC; Supplier Part: C54916872; Manufacturer: TORCH(火炬); Contributor: lcsc; JLCPCB Part Class: Extended Part
C2 = CSA0805C0G103J500MT: Supplier: LCSC; Supplier Part: C49270298; Manufacturer: HRE(芯声); JLCPCB Part Class: Extended Part; Contributor: lcsc
C3 C4 = 600F330JT250XT: Supplier: LCSC; Supplier Part: C3838790; Manufacturer: Kyocera AVX; Contributor: lcsc; JLCPCB Part Class: Extended Part
LED1-LED256 = HL-A-5730D34WY-S1-08-CZ(LY): Supplier: LCSC; Supplier Part: C49435712; Manufacturer: HONGLITRONIC(鸿利光电); JLCPCB Part Class: Extended Part; Contributor: lcsc; Package Display: No
R1-R3 = R_0603_EU: Contributor: LCEDA_Lib
U1 U3 = 74HC238D: Supplier: LCSC; Manufacturer: Nexperia(安世); Manufacturer Part: 74HC238D,653; Supplier Part: C5620; JLCPCB Part Class: Extended Part
U2 = CD74HC4060M96: Supplier: LCSC; Manufacturer: TI(德州仪器); Supplier Part: C134017; JLCPCB Part Class: Extended Part
X1 = SCFYS32X76800YERN: Supplier: LCSC; Supplier Part: C50396607; Manufacturer: SOSET(索斯特); JLCPCB Part Class: Extended Part; Contributor: lcsc

## Nets
+3.3V: C1.2 C2.2 U1.16(VCC) U2.16(VCC) U3.16(VCC)
GND: C1.1 C2.1 C3.1 C4.1 R3.1 U1.8(GND) U2.8(GND) U3.8(GND)
1: LED9.2(A) LED24.2(A) LED41.2(A) LED57.2(A) LED73.2(A) LED89.2(A) LED105.2(A) LED121.2(A) LED136.2(A) LED152.2(A) LED168.2(A) LED184.2(A) LED200.2(A) LED216.2(A) LED232.2(A) LED248.2(A)
2: LED10.2(A) LED23.2(A) LED42.2(A) LED58.2(A) LED74.2(A) LED90.2(A) LED106.2(A) LED122.2(A) LED135.2(A) LED151.2(A) LED167.2(A) LED183.2(A) LED199.2(A) LED215.2(A) LED231.2(A) LED247.2(A)
3: LED11.2(A) LED22.2(A) LED43.2(A) LED59.2(A) LED75.2(A) LED91.2(A) LED107.2(A) LED123.2(A) LED134.2(A) LED150.2(A) LED166.2(A) LED182.2(A) LED198.2(A) LED214.2(A) LED230.2(A) LED246.2(A)
4: LED12.2(A) LED21.2(A) LED44.2(A) LED60.2(A) LED76.2(A) LED92.2(A) LED108.2(A) LED124.2(A) LED133.2(A) LED149.2(A) LED165.2(A) LED181.2(A) LED197.2(A) LED213.2(A) LED229.2(A) LED245.2(A)
5: LED13.2(A) LED20.2(A) LED45.2(A) LED61.2(A) LED77.2(A) LED93.2(A) LED109.2(A) LED125.2(A) LED132.2(A) LED148.2(A) LED164.2(A) LED180.2(A) LED196.2(A) LED212.2(A) LED228.2(A) LED244.2(A)
6: LED14.2(A) LED19.2(A) LED46.2(A) LED62.2(A) LED78.2(A) LED94.2(A) LED110.2(A) LED126.2(A) LED131.2(A) LED147.2(A) LED163.2(A) LED179.2(A) LED195.2(A) LED211.2(A) LED227.2(A) LED243.2(A)
7: LED15.2(A) LED18.2(A) LED47.2(A) LED63.2(A) LED79.2(A) LED95.2(A) LED111.2(A) LED127.2(A) LED130.2(A) LED146.2(A) LED162.2(A) LED178.2(A) LED194.2(A) LED210.2(A) LED226.2(A) LED242.2(A)
8: LED16.2(A) LED17.2(A) LED48.2(A) LED64.2(A) LED80.2(A) LED96.2(A) LED112.2(A) LED128.2(A) LED129.2(A) LED145.2(A) LED161.2(A) LED177.2(A) LED193.2(A) LED209.2(A) LED225.2(A) LED241.2(A)
9: LED8.2(A) LED25.2(A) LED40.2(A) LED56.2(A) LED72.2(A) LED88.2(A) LED104.2(A) LED120.2(A) LED137.2(A) LED153.2(A) LED169.2(A) LED185.2(A) LED201.2(A) LED217.2(A) LED233.2(A) LED249.2(A)
10: LED7.2(A) LED26.2(A) LED39.2(A) LED55.2(A) LED71.2(A) LED87.2(A) LED103.2(A) LED119.2(A) LED138.2(A) LED154.2(A) LED170.2(A) LED186.2(A) LED202.2(A) LED218.2(A) LED234.2(A) LED250.2(A)
11: LED6.2(A) LED27.2(A) LED38.2(A) LED54.2(A) LED70.2(A) LED86.2(A) LED102.2(A) LED118.2(A) LED139.2(A) LED155.2(A) LED171.2(A) LED187.2(A) LED203.2(A) LED219.2(A) LED235.2(A) LED251.2(A)
12: LED5.2(A) LED28.2(A) LED37.2(A) LED53.2(A) LED69.2(A) LED85.2(A) LED101.2(A) LED117.2(A) LED140.2(A) LED156.2(A) LED172.2(A) LED188.2(A) LED204.2(A) LED220.2(A) LED236.2(A) LED252.2(A)
13: LED4.2(A) LED29.2(A) LED36.2(A) LED52.2(A) LED68.2(A) LED84.2(A) LED100.2(A) LED116.2(A) LED141.2(A) LED157.2(A) LED173.2(A) LED189.2(A) LED205.2(A) LED221.2(A) LED237.2(A) LED253.2(A)
14: LED3.2(A) LED30.2(A) LED35.2(A) LED51.2(A) LED67.2(A) LED83.2(A) LED99.2(A) LED115.2(A) LED142.2(A) LED158.2(A) LED174.2(A) LED190.2(A) LED206.2(A) LED222.2(A) LED238.2(A) LED254.2(A)
15: LED2.2(A) LED31.2(A) LED34.2(A) LED50.2(A) LED66.2(A) LED82.2(A) LED98.2(A) LED114.2(A) LED143.2(A) LED159.2(A) LED175.2(A) LED191.2(A) LED207.2(A) LED223.2(A) LED239.2(A) LED255.2(A)
16: LED1.2(A) LED32.2(A) LED33.2(A) LED49.2(A) LED65.2(A) LED81.2(A) LED97.2(A) LED113.2(A) LED144.2(A) LED160.2(A) LED176.2(A) LED192.2(A) LED208.2(A) LED224.2(A) LED240.2(A) LED256.2(A)
A: LED145.1(C) LED146.1(C) LED147.1(C) LED148.1(C) LED149.1(C) LED150.1(C) LED151.1(C) LED152.1(C) LED153.1(C) LED154.1(C) LED155.1(C) LED156.1(C) LED157.1(C) LED158.1(C) LED159.1(C) LED160.1(C)
B: LED129.1(C) LED130.1(C) LED131.1(C) LED132.1(C) LED133.1(C) LED134.1(C) LED135.1(C) LED136.1(C) LED137.1(C) LED138.1(C) LED139.1(C) LED140.1(C) LED141.1(C) LED142.1(C) LED143.1(C) LED144.1(C)
C: LED177.1(C) LED178.1(C) LED179.1(C) LED180.1(C) LED181.1(C) LED182.1(C) LED183.1(C) LED184.1(C) LED185.1(C) LED186.1(C) LED187.1(C) LED188.1(C) LED189.1(C) LED190.1(C) LED191.1(C) LED192.1(C)
D: LED161.1(C) LED162.1(C) LED163.1(C) LED164.1(C) LED165.1(C) LED166.1(C) LED167.1(C) LED168.1(C) LED169.1(C) LED170.1(C) LED171.1(C) LED172.1(C) LED173.1(C) LED174.1(C) LED175.1(C) LED176.1(C)
E: LED209.1(C) LED210.1(C) LED211.1(C) LED212.1(C) LED213.1(C) LED214.1(C) LED215.1(C) LED216.1(C) LED217.1(C) LED218.1(C) LED219.1(C) LED220.1(C) LED221.1(C) LED222.1(C) LED223.1(C) LED224.1(C)
F: LED193.1(C) LED194.1(C) LED195.1(C) LED196.1(C) LED197.1(C) LED198.1(C) LED199.1(C) LED200.1(C) LED201.1(C) LED202.1(C) LED203.1(C) LED204.1(C) LED205.1(C) LED206.1(C) LED207.1(C) LED208.1(C)
G: LED241.1(C) LED242.1(C) LED243.1(C) LED244.1(C) LED245.1(C) LED246.1(C) LED247.1(C) LED248.1(C) LED249.1(C) LED250.1(C) LED251.1(C) LED252.1(C) LED253.1(C) LED254.1(C) LED255.1(C) LED256.1(C)
H: LED225.1(C) LED226.1(C) LED227.1(C) LED228.1(C) LED229.1(C) LED230.1(C) LED231.1(C) LED232.1(C) LED233.1(C) LED234.1(C) LED235.1(C) LED236.1(C) LED237.1(C) LED238.1(C) LED239.1(C) LED240.1(C)
I: LED97.1(C) LED98.1(C) LED99.1(C) LED100.1(C) LED101.1(C) LED102.1(C) LED103.1(C) LED104.1(C) LED105.1(C) LED106.1(C) LED107.1(C) LED108.1(C) LED109.1(C) LED110.1(C) LED111.1(C) LED112.1(C)
J: LED113.1(C) LED114.1(C) LED115.1(C) LED116.1(C) LED117.1(C) LED118.1(C) LED119.1(C) LED120.1(C) LED121.1(C) LED122.1(C) LED123.1(C) LED124.1(C) LED125.1(C) LED126.1(C) LED127.1(C) LED128.1(C)
K: LED65.1(C) LED66.1(C) LED67.1(C) LED68.1(C) LED69.1(C) LED70.1(C) LED71.1(C) LED72.1(C) LED73.1(C) LED74.1(C) LED75.1(C) LED76.1(C) LED77.1(C) LED78.1(C) LED79.1(C) LED80.1(C)
L: LED81.1(C) LED82.1(C) LED83.1(C) LED84.1(C) LED85.1(C) LED86.1(C) LED87.1(C) LED88.1(C) LED89.1(C) LED90.1(C) LED91.1(C) LED92.1(C) LED93.1(C) LED94.1(C) LED95.1(C) LED96.1(C)
M: LED33.1(C) LED34.1(C) LED35.1(C) LED36.1(C) LED37.1(C) LED38.1(C) LED39.1(C) LED40.1(C) LED41.1(C) LED42.1(C) LED43.1(C) LED44.1(C) LED45.1(C) LED46.1(C) LED47.1(C) LED48.1(C)
N: LED49.1(C) LED50.1(C) LED51.1(C) LED52.1(C) LED53.1(C) LED54.1(C) LED55.1(C) LED56.1(C) LED57.1(C) LED58.1(C) LED59.1(C) LED60.1(C) LED61.1(C) LED62.1(C) LED63.1(C) LED64.1(C)
O: LED17.1(C) LED18.1(C) LED19.1(C) LED20.1(C) LED21.1(C) LED22.1(C) LED23.1(C) LED24.1(C) LED25.1(C) LED26.1(C) LED27.1(C) LED28.1(C) LED29.1(C) LED30.1(C) LED31.1(C) LED32.1(C)
P: LED1.1(C) LED2.1(C) LED3.1(C) LED4.1(C) LED5.1(C) LED6.1(C) LED7.1(C) LED8.1(C) LED9.1(C) LED10.1(C) LED11.1(C) LED12.1(C) LED13.1(C) LED14.1(C) LED15.1(C) LED16.1(C)
Net-(C3-2): C3.2 R1.1 U2.11(φI) X1.1
Net-(C4-2): C4.2 R2.1 X1.2
Net-(R1-2): R1.2 R2.2 U2.10(φO#)
Net-(R3-2): R3.2 U2.12(MR)
Net-(U1-1): U1.1(A0) U2.7(Q4) U3.1(A0)
Net-(U1-2): U1.2(A1) U2.5(Q5) U3.2(A1)
Net-(U1-3): U1.3(A2) U2.4(Q6) U3.3(A2)
Net-(U1-5): U1.5(E2#) U2.6(Q7) U3.6(E3)

Not connected (* = marked no-connect by the designer): LED1 3; LED2 3; LED3 3; LED4 3; LED5 3; LED6 3; LED7 3; LED8 3; LED9 3; LED10 3; LED11 3; LED12 3; LED13 3; LED14 3; LED15 3; LED16 3; LED17 3; LED18 3; LED19 3; LED20 3; LED21 3; LED22 3; LED23 3; LED24 3; LED25 3; LED26 3; LED27 3; LED28 3; LED29 3; LED30 3; LED31 3; LED32 3; LED33 3; LED34 3; LED35 3; LED36 3; LED37 3; LED38 3; LED39 3; LED40 3; LED41 3; LED42 3; LED43 3; LED44 3; LED45 3; LED46 3; LED47 3; LED48 3; LED49 3; LED50 3; LED51 3; LED52 3; LED53 3; LED54 3; LED55 3; LED56 3; LED57 3; LED58 3; LED59 3; LED60 3; LED61 3; LED62 3; LED63 3; LED64 3; LED65 3; LED66 3; LED67 3; LED68 3; LED69 3; LED70 3; LED71 3; LED72 3; LED73 3; LED74 3; LED75 3; LED76 3; LED77 3; LED78 3; LED79 3; LED80 3; LED81 3; LED82 3; LED83 3; LED84 3; LED85 3; LED86 3; LED87 3; LED88 3; LED89 3; LED90 3; LED91 3; LED92 3; LED93 3; LED94 3; LED95 3; LED96 3; LED97 3; LED98 3; LED99 3; LED100 3; LED101 3; LED102 3; LED103 3; LED104 3; LED105 3; LED106 3; LED107 3; LED108 3; LED109 3; LED110 3; LED111 3; LED112 3; LED113 3; LED114 3; LED115 3; LED116 3; LED117 3; LED118 3; LED119 3; LED120 3; LED121 3; LED122 3; LED123 3; LED124 3; LED125 3; LED126 3; LED127 3; LED128 3; LED129 3; LED130 3; LED131 3; LED132 3; LED133 3; LED134 3; LED135 3; LED136 3; LED137 3; LED138 3; LED139 3; LED140 3; LED141 3; LED142 3; LED143 3; LED144 3; LED145 3; LED146 3; LED147 3; LED148 3; LED149 3; LED150 3; LED151 3; LED152 3; LED153 3; LED154 3; LED155 3; LED156 3; LED157 3; LED158 3; LED159 3; LED160 3; LED161 3; LED162 3; LED163 3; LED164 3; LED165 3; LED166 3; LED167 3; LED168 3; LED169 3; LED170 3; LED171 3; LED172 3; LED173 3; LED174 3; LED175 3; LED176 3; LED177 3; LED178 3; LED179 3; LED180 3; LED181 3; LED182 3; LED183 3; LED184 3; LED185 3; LED186 3; LED187 3; LED188 3; LED189 3; LED190 3; LED191 3; LED192 3; LED193 3; LED194 3; LED195 3; LED196 3; LED197 3; LED198 3; LED199 3; LED200 3; LED201 3; LED202 3; LED203 3; LED204 3; LED205 3; LED206 3; LED207 3; LED208 3; LED209 3; LED210 3; LED211 3; LED212 3; LED213 3; LED214 3; LED215 3; LED216 3; LED217 3; LED218 3; LED219 3; LED220 3; LED221 3; LED222 3; LED223 3; LED224 3; LED225 3; LED226 3; LED227 3; LED228 3; LED229 3; LED230 3; LED231 3; LED232 3; LED233 3; LED234 3; LED235 3; LED236 3; LED237 3; LED238 3; LED239 3; LED240 3; LED241 3; LED242 3; LED243 3; LED244 3; LED245 3; LED246 3; LED247 3; LED248 3; LED249 3; LED250 3; LED251 3; LED252 3; LED253 3; LED254 3; LED255 3; LED256 3; U1 4(E1#) 6(E3) 7(Y7) 9(Y6) 10(Y5) 11(Y4) 12(Y3) 13(Y2) 14(Y1) 15(Y0); U2 1(Q12) 2(Q13) 3(Q14) 9(φO) 13(Q9) 14(Q8) 15(Q10); U3 4(E1#) 5(E2#) 7(Y7) 9(Y6) 10(Y5) 11(Y4) 12(Y3) 13(Y2) 14(Y1) 15(Y0)
